# Altium schematic sheet PROB_S7CAS_FLASH-JTAG.SchDoc
size Tabloid; SheetNumber: 15; SheetTotal: 15; Sheet_Name: Mémoire Flash FPGA; Size: 11x17
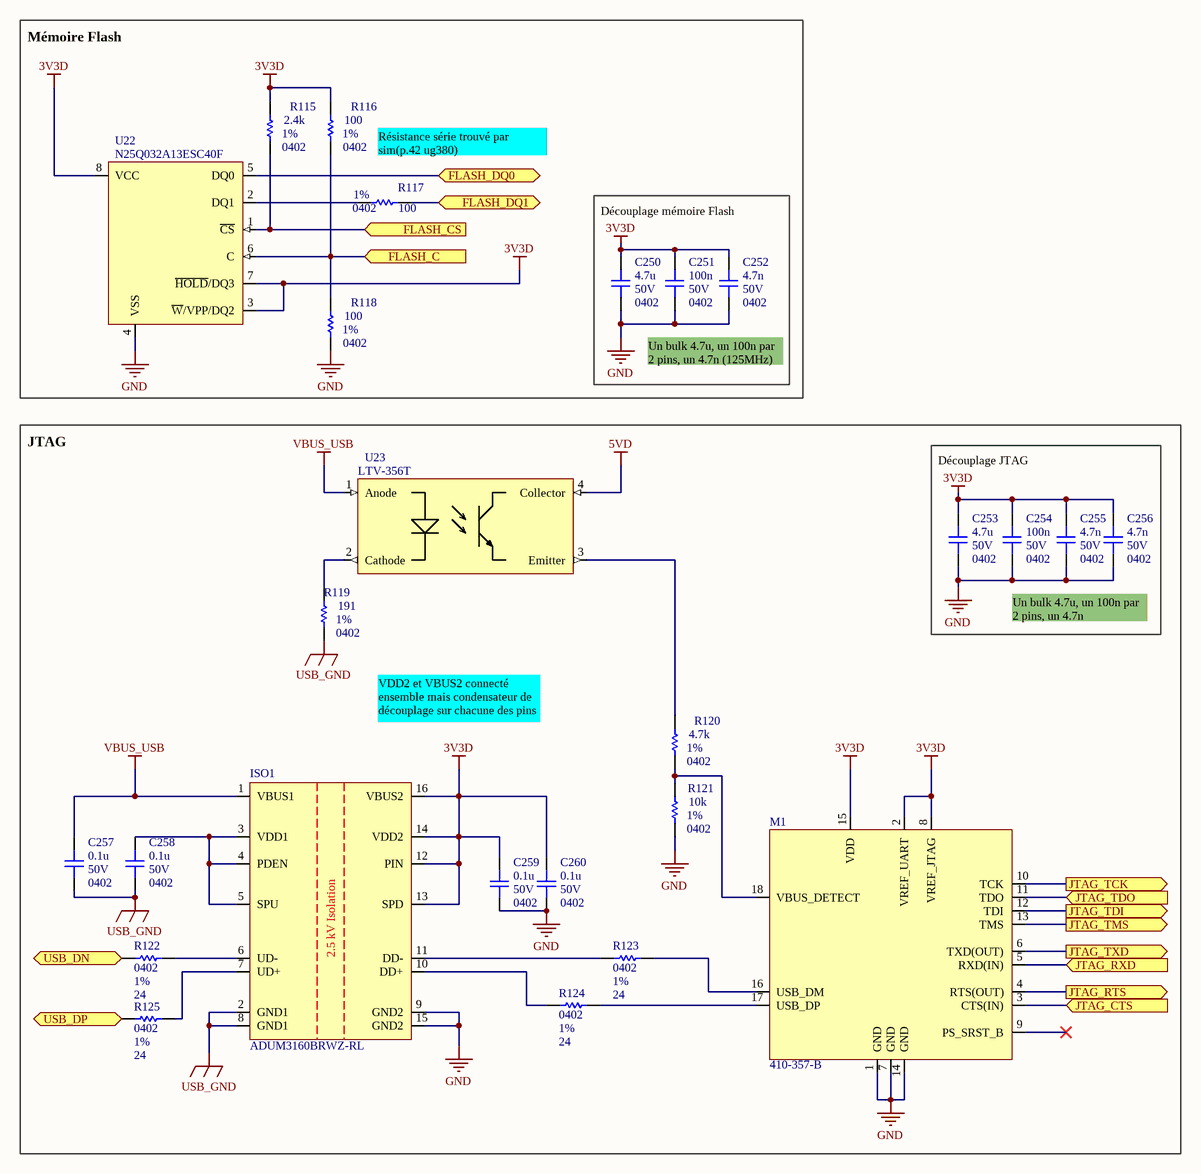
[diagram p0: PROB_S7CAS_FLASH-JTAG.SchDoc]

## Parts
C250  value 4.7u  Voltage: 50V  Package: 0402  [CAP_0402]  (hidden comment: CAP - 0402)
C251  value 100n  Voltage: 50V  Package: 0402  [CAP_0402]  (hidden comment: CAP - 0402)
C252  value 4.7n  Voltage: 50V  Package: 0402  [CAP_0402]  (hidden comment: CAP - 0402)
C253  value 4.7u  Voltage: 50V  Package: 0402  [CAP_0402]  (hidden comment: CAP - 0402)
C254  value 100n  Voltage: 50V  Package: 0402  [CAP_0402]  (hidden comment: CAP - 0402)
C255  value 4.7n  Voltage: 50V  Package: 0402  [CAP_0402]  (hidden comment: CAP - 0402)
C256  value 4.7n  Voltage: 50V  Package: 0402  [CAP_0402]  (hidden comment: CAP - 0402)
C257  value 0.1u  Voltage: 50V  Package: 0402  [CAP_0402]  (hidden comment: CAP - 0402)
C258  value 0.1u  Voltage: 50V  Package: 0402  [CAP_0402]  (hidden comment: CAP - 0402)
C259  value 0.1u  Voltage: 50V  Package: 0402  [CAP_0402]  (hidden comment: CAP - 0402)
C260  value 0.1u  Voltage: 50V  Package: 0402  [CAP_0402]  (hidden comment: CAP - 0402)
ISO1  ADUM3160BRWZ-RL  [ISO_ADUM3160BRWZ-RL]
M1  410-357-B  [MOD_JTAG_410-357-B]
R115  value 2.4k  Package: 0402  Precision: 1%  [RES_0402]  (hidden comment: RES - 0402)
R116  value 100  Package: 0402  Precision: 1%  [RES_0402]  (hidden comment: RES - 0402)
R117  value 100  Package: 0402  Precision: 1%  [RES_0402]  (hidden comment: RES - 0402)
R118  value 100  Package: 0402  Precision: 1%  [RES_0402]  (hidden comment: RES - 0402)
R119  value 191  Package: 0402  Precision: 1%  [RES_0402]  (hidden comment: RES - 0402)
R120  value 4.7k  Package: 0402  Precision: 1%  [RES_0402]  (hidden comment: RES - 0402)
R121  value 10k  Package: 0402  Precision: 1%  [RES_0402]  (hidden comment: RES - 0402)
R122  value 24  Package: 0402  Precision: 1%  [RES_0402]  (hidden comment: RES - 0402)
R123  value 24  Package: 0402  Precision: 1%  [RES_0402]  (hidden comment: RES - 0402)
R124  value 24  Package: 0402  Precision: 1%  [RES_0402]  (hidden comment: RES - 0402)
R125  value 24  Package: 0402  Precision: 1%  [RES_0402]  (hidden comment: RES - 0402)
U22  N25Q032A13ESC40F  [SOIC127P790X216-8N]
U23  LTV-356T  [SOP254P700X240-4N]

## Ports
FLASH_C (in), FLASH_CS (in), FLASH_DQ0 (bidir), FLASH_DQ1 (bidir), JTAG_CTS (in), JTAG_RTS (out), JTAG_RXD (in), JTAG_TCK (out), JTAG_TDI (out), JTAG_TDO (in), JTAG_TMS (out), JTAG_TXD (out), USB_DN (bidir), USB_DP (bidir)

## Nets
3V3D: C250.2 C251.2 C252.2 C253.2 C254.2 C255.2 C256.2 C259.2 C260.2 ISO1.12(PIN) ISO1.13(SPD) ISO1.14(VDD2) ISO1.16(VBUS2) M1.2(VREF_UART) M1.8(VREF_JTAG) M1.15(VDD) R115.2 R116.2 U22.3(~{W}/VPP/DQ2) U22.7(~{HOLD}/DQ3) U22.8(VCC)
5VD: U23.4(Collector)
GND: C250.1 C251.1 C252.1 C253.1 C254.1 C255.1 C256.1 C259.1 C260.1 ISO1.9(GND2) ISO1.15(GND2) M1.1(GND) M1.7(GND) M1.14(GND) R118.1 R121.1 U22.4(VSS)
USB_GND: C257.1 C258.1 ISO1.2(GND1) ISO1.8(GND1) R119.1
VBUS_USB: C257.2 ISO1.1(VBUS1) U23.1(Anode)
FLASH_C: R116.1 R118.2 U22.6(C) ; port FLASH_C
FLASH_CS: R115.1 U22.1(~{CS}) ; port FLASH_CS
FLASH_DQ0: U22.5(DQ0) ; port FLASH_DQ0
FLASH_DQ1: R117.2 ; port FLASH_DQ1
JTAG_CTS: M1.3(CTS(IN)) ; port JTAG_CTS
JTAG_RTS: M1.4(RTS(OUT)) ; port JTAG_RTS
JTAG_RXD: M1.5(RXD(IN)) ; port JTAG_RXD
JTAG_TCK: M1.10(TCK) ; port JTAG_TCK
JTAG_TDI: M1.12(TDI) ; port JTAG_TDI
JTAG_TDO: M1.11(TDO) ; port JTAG_TDO
JTAG_TMS: M1.13(TMS) ; port JTAG_TMS
JTAG_TXD: M1.6(TXD(OUT)) ; port JTAG_TXD
USB_DN: R122.2 ; port USB_DN
USB_DP: R125.2 ; port USB_DP
NetC258_2: C258.2 ISO1.3(VDD1) ISO1.4(PDEN) ISO1.5(SPU)
NetISO1_6: ISO1.6(UD-) R122.1
NetISO1_7: ISO1.7(UD+) R125.1
NetISO1_10: ISO1.10(DD+) R124.2
NetISO1_11: ISO1.11(DD-) R123.2
NetM1_16: M1.16(USB_DM) R123.1
NetM1_17: M1.17(USB_DP) R124.1
NetM1_18: M1.18(VBUS_DETECT) R120.1 R121.2
NetR117_1: R117.1 U22.2(DQ1)
NetR119_2: R119.2 U23.2(Cathode)
NetR120_2: R120.2 U23.3(Emitter)

Not connected (* = marked no-connect by the designer): M1 9(PS_SRST_B)*

## Notes on the sheet
- Mémoire Flash
- Résistance série trouvé par sim(p.42 ug380)
- Découplage mémoire Flash
- Un bulk 4.7u, un 100n par 2 pins, un 4.7n (125MHz)
- JTAG
- Découplage JTAG
- Un bulk 4.7u, un 100n par 2 pins, un 4.7n
- VDD2 et VBUS2 connecté ensemble mais condensateur de découplage sur chacune des pins
- Sheet Name
- Project Title
- Global Project
- Size
- Group
- Revision
- Date
- Sheet
- of
- Filename
- Designers
- (in symbol ISO_ADUM3160BRWZ-RL) 2.5 kV Isolation

## Library data of the parts
C250-C260 = CAP - 0402: Precision: 10%; Current: *; CreatedBy: Jonathan Bouchard; Power: *
ISO1 = ISO_ADUM3160BRWZ-RL: ISO - DGTL ISO 2.5KV 2CH USB - 16SOIC; Manufacturer #1: Analog Devices; Value: 2500Vrms voltage isolation; Voltage Rating: 3~5.5V; GRAMS Lib Spec: 2.8; Magnetic Material: UNKNOWN; Polarized: Yes; Tolerance: *; Current Rating: *; Power Max: *; HelpURL: https://www.analog.com/media/en/technical-documentation/data-sheets/ADuM3160.pdf; CreatedBy/Date: Tommy Rossignol 2018-11-16; VerifiedBy: Caroline Paulin - 13 février 2019; Temperature: -40°C ~ 105°C; Package: 16-SOIC; Manufacturer #2: *; Assembly Type: SMD; Part Number #2: *; Part Number #1: ADUM3160BRWZ-RL; Supplier 1: Digi-Key; Supplier Part Number 1: ADUM3160BRWZ-RLCT-ND; Cryo: UNKNOWN
M1 = MOD_JTAG_410-357-B: MOD - JTAG-SMT3-NC Programming Module For Xilinx FPGA - 18-SMT; Manufacturer #1: Digilent; Voltage Rating: VDD: 2.97V~3.63V, VJTAG/VUART: 1.65V~5.5V; GRAMS Lib Spec: 2.8; Note: Prior to reflow, the JTAG-SMT3-NC module must be dried at 125°C for 17 hours; Magnetic Material: Unknown; Polarized: Yes; Value: *; Tolerance: *; Current Rating: *; Power Max: *; HelpURL: https://reference.digilentinc.com/_media/reference/programmers/jtag-smt3/jtag-smt3-nc_rm.pdf; CreatedBy/Date: Tommy Rossignol 2018-11-23; VerifiedBy: Nicolas V. (2019-01-28); Temperature: -40°C ~ 85°C; Package: 18-pad SMT; Manufacturer #2: *; Assembly Type: SMD; Part Number #2: *; Part Number #1: 410-357-B; Supplier 1: Digi-Key; Supplier Part Number 1: 1286-1196-ND; Cryo: UNKNOWN
R115-R125 = RES - 0402: Voltage: 50V; Power: 1/16W; Current: *; CreatedBy: Jonathan Bouchard
U22 = IC FLASH 32MBIT SPI 108MHZ 8SO: N25Q032A - 32Mb, 3V, Multiple I/O Serial Flash Memory - 8-SOIC (0.209", 5.30mm Width); GRAMS Lib Spec: 2.7; HelpURL: https://www.alliancememory.com/wp-content/uploads/pdf/micron/Micron_Datasheet_N25Q032A_RevJ.pdf
U23 = LTV-356T: LTV-356T - OPTOISOLATOR 3.75KV TRANS - 4-SOP; GRAMS Lib Spec: 2.7; HelpURL: https://optoelectronics.liteon.com/upload/download/DS70-2001-010/LTV-356T%20series%20Rev.P.PDF